# EAGLE schematic ElectricalSchematic v11 (EAGLE 9.7.0)
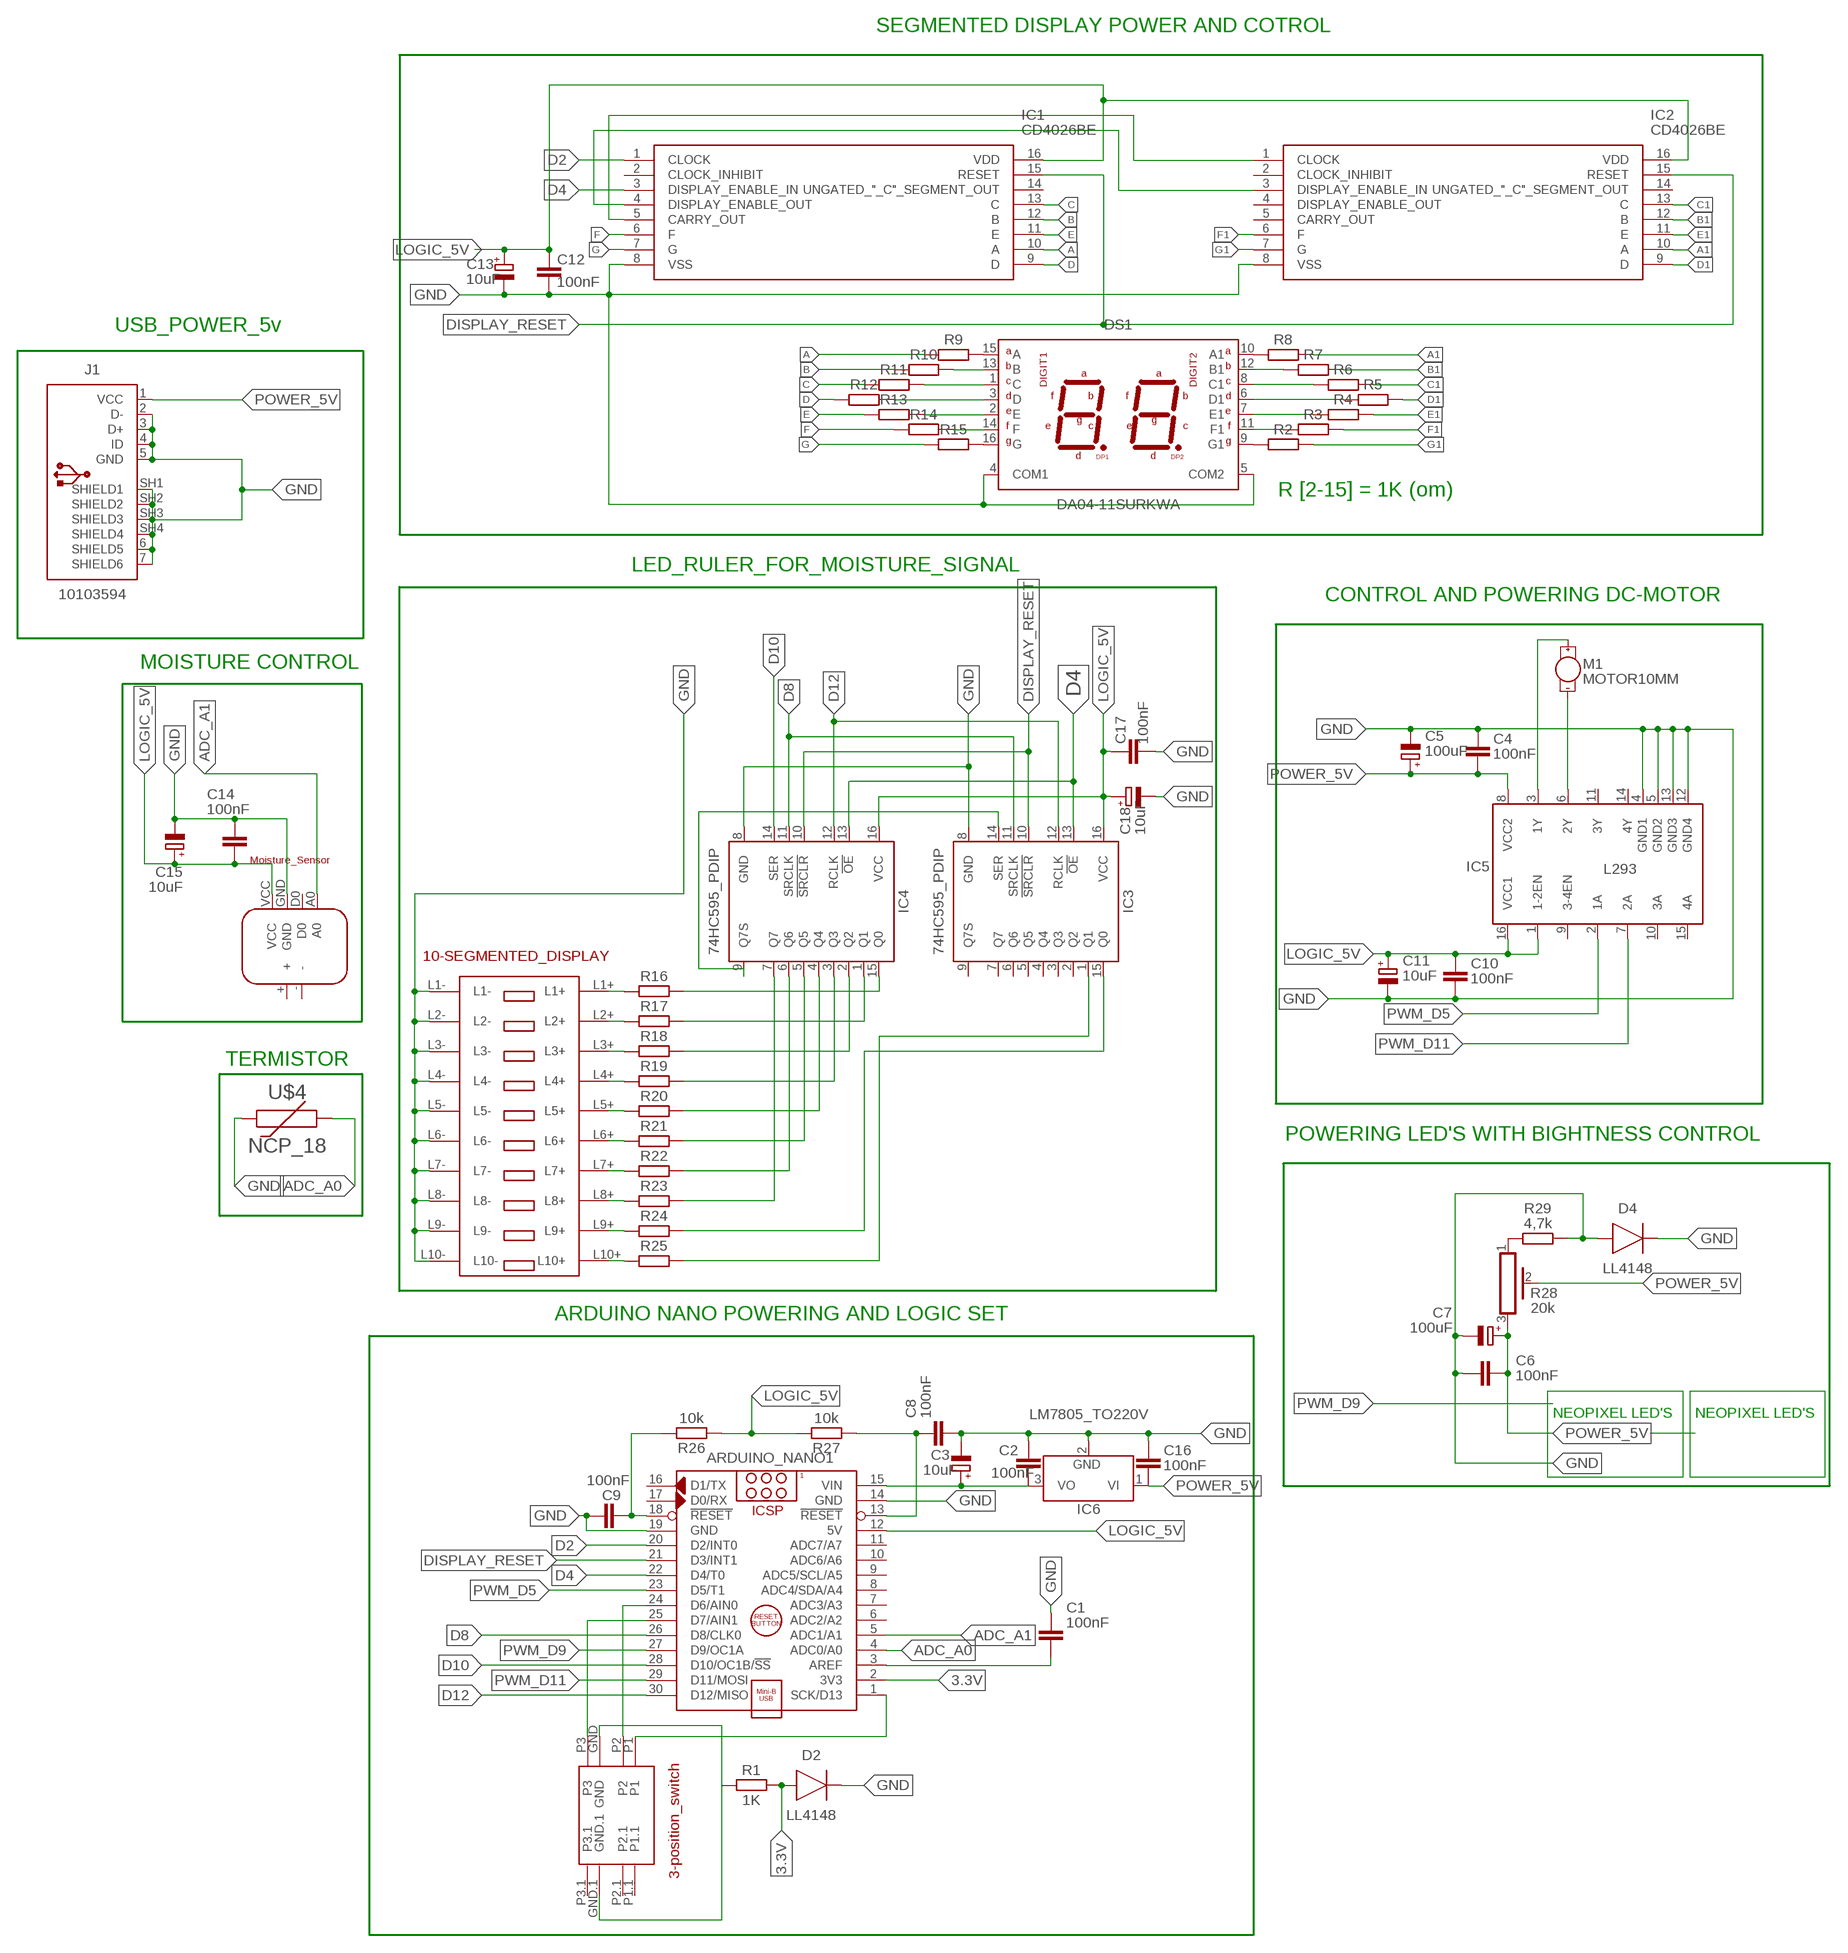
[diagram p0: schematic, sheet 1]

## Parts
ARDUINO_NANO1  ARDUINO_NANO  [ARDUINO_NANO]
C1  100nF  C_RADIAL-55.5MM-DIA  [CAPRD2261W240D5080H5555B]
C2  100nF  C_RADIAL-55.5MM-DIA  [CAPRD2261W240D5080H5555B]
C3  10uF  C-POL_RADIAL-11MM-DIA  [CAPPRD508W65D1000H1100B]
C4  100nF  C_RADIAL-55.5MM-DIA  [CAPRD2261W240D5080H5555B]
C5  100uF  C-POL_RADIAL-11MM-DIA  [CAPPRD508W65D1000H1100B]
C6  100nF  C_RADIAL-55.5MM-DIA  [CAPRD2261W240D5080H5555B]
C7  100uF  C-POL_RADIAL-11MM-DIA  [CAPPRD508W65D1000H1100B]
C8  100nF  C_RADIAL-55.5MM-DIA  [CAPRD2261W240D5080H5555B]
C9  100nF  C_RADIAL-55.5MM-DIA  [CAPRD2261W240D5080H5555B]
C10  100nF  C_RADIAL-55.5MM-DIA  [CAPRD2261W240D5080H5555B]
C11  10uF  C-POL_RADIAL-11MM-DIA  [CAPPRD508W65D1000H1100B]
C12  100nF  C_RADIAL-55.5MM-DIA  [CAPRD2261W240D5080H5555B]
C13  10uF  C-POL_RADIAL-11MM-DIA  [CAPPRD508W65D1000H1100B]
C14  100nF  C_RADIAL-55.5MM-DIA  [CAPRD2261W240D5080H5555B]
C15  10uF  C-POL_RADIAL-11MM-DIA  [CAPPRD508W65D1000H1100B]
C16  100nF  C_RADIAL-55.5MM-DIA  [CAPRD2261W240D5080H5555B]
C17  100nF  C_RADIAL-55.5MM-DIA  [CAPRD2261W240D5080H5555B]
C18  10uF  C-POL_RADIAL-11MM-DIA  [CAPPRD508W65D1000H1100B]
D2  LL4148  DIODE_LL4148_SOD-80  [DIOMELF3516]
D4  LL4148  DIODE_LL4148_SOD-80  [DIOMELF3516]
DS1  DA04-11SURKWA  [D*04-11SURKWA]
IC1  CD4026BE  [DIP794W53P254L1930H508Q16N]
IC2  CD4026BE  [DIP794W53P254L1930H508Q16N]
IC3  74HC595_PDIP  [DIP762W53P254L1969H508Q16B]
IC4  74HC595_PDIP  [DIP762W53P254L1969H508Q16B]
IC5  L293  [DIP762W53P254L1969H508Q16B]
IC6  LM7805_TO220V  [TO220V]
J1  10103594  [10103594]
M1  MOTOR10MM  [VIBE-MOTOR-10MM]
R1  1K  R_AXIAL-7.2MM-PITCH  [RESAD724W46L381D178B]
R2  R_AXIAL-7.2MM-PITCH  [RESAD724W46L381D178B]
R3  R_AXIAL-7.2MM-PITCH  [RESAD724W46L381D178B]
R4  R_AXIAL-7.2MM-PITCH  [RESAD724W46L381D178B]
R5  R_AXIAL-7.2MM-PITCH  [RESAD724W46L381D178B]
R6  R_AXIAL-7.2MM-PITCH  [RESAD724W46L381D178B]
R7  R_AXIAL-7.2MM-PITCH  [RESAD724W46L381D178B]
R8  R_AXIAL-7.2MM-PITCH  [RESAD724W46L381D178B]
R9  R_AXIAL-7.2MM-PITCH  [RESAD724W46L381D178B]
R10  R_AXIAL-7.2MM-PITCH  [RESAD724W46L381D178B]
R11  R_AXIAL-7.2MM-PITCH  [RESAD724W46L381D178B]
R12  R_AXIAL-7.2MM-PITCH  [RESAD724W46L381D178B]
R13  R_AXIAL-7.2MM-PITCH  [RESAD724W46L381D178B]
R14  R_AXIAL-7.2MM-PITCH  [RESAD724W46L381D178B]
R15  R_AXIAL-7.2MM-PITCH  [RESAD724W46L381D178B]
R16  R_AXIAL-7.2MM-PITCH  [RESAD724W46L381D178B]
R17  R_AXIAL-7.2MM-PITCH  [RESAD724W46L381D178B]
R18  R_AXIAL-7.2MM-PITCH  [RESAD724W46L381D178B]
R19  R_AXIAL-7.2MM-PITCH  [RESAD724W46L381D178B]
R20  R_AXIAL-7.2MM-PITCH  [RESAD724W46L381D178B]
R21  R_AXIAL-7.2MM-PITCH  [RESAD724W46L381D178B]
R22  R_AXIAL-7.2MM-PITCH  [RESAD724W46L381D178B]
R23  R_AXIAL-7.2MM-PITCH  [RESAD724W46L381D178B]
R24  R_AXIAL-7.2MM-PITCH  [RESAD724W46L381D178B]
R25  R_AXIAL-7.2MM-PITCH  [RESAD724W46L381D178B]
R26  10k  R_AXIAL-7.2MM-PITCH  [RESAD724W46L381D178B]
R27  10k  R_AXIAL-7.2MM-PITCH  [RESAD724W46L381D178B]
R28  20k  PV36Z  [PV36Z]
R29  4,7k  R_AXIAL-7.2MM-PITCH  [RESAD724W46L381D178B]
U$2  10-SEGMENTED_DISPLAY10-SEGMENTED_DISPLAY_V2  [10-SEGMENTED_DIS_FOOTPRINT]
U$3  3POZ_SWITCH  [3-POZ-SWITCH]
U$4  NCP_18  [THRMC1608X95]
U$5  MOISTURE_SENSOR  [MOISTURE]

## Nets
3.3V: ARDUINO_NANO1.2(3V3) D2.2(A) R1.2
A: IC1.10(A) R9.1
A1: IC2.10(A) R8.2
ADC_A0: ARDUINO_NANO1.4(ADC0/A0) U$4.2
ADC_A1: ARDUINO_NANO1.5(ADC1/A1) U$5.A0
B: IC1.12(B) R10.1
B1: IC2.12(B) R7.2
C: IC1.13(C) R11.1
C1: IC2.13(C) R6.2
CONNECTING_OTHER_74HC: IC3.14(SER) IC4.9(Q7S)
D: IC1.9(D) R12.1
D1: IC2.9(D) R5.2
D2: ARDUINO_NANO1.20(D2/INT0) IC1.1(CLOCK)
D4: ARDUINO_NANO1.22(D4/T0) IC1.3(DISPLAY_ENABLE_IN) IC3.13(!OE) IC4.13(!OE)
D8: ARDUINO_NANO1.26(D8/CLK0) IC3.11(SRCLK) IC4.11(SRCLK)
D10: ARDUINO_NANO1.28(D10/OC1B/!SS) IC4.14(SER)
D12: ARDUINO_NANO1.30(D12/MISO) IC3.12(RCLK) IC4.12(RCLK)
DISPLAY_RESET: ARDUINO_NANO1.21(D3/INT1) IC1.15(RESET) IC2.15(RESET) IC3.10(!SRCLR) IC4.10(!SRCLR)
E: IC1.11(E) R13.1
E1: IC2.11(E) R4.2
F: IC1.6(F) R14.1
F1: IC2.6(F) R3.2
G: IC1.7(G) R15.1
G1: IC2.7(G) R2.2
GND: ARDUINO_NANO1.14(GND) ARDUINO_NANO1.19(GND) C1.1 C2.2 C3.2(-) C4.2 C5.2(-) C6.1 C7.2(-) C8.2 C9.1 C10.1 C11.2(-) C12.1 C13.2(-) C14.2 C15.2(-) C16.2 C17.1 C18.2(-) D2.1(C) D4.1(C) D4.2(A) DS1.4(COM1) DS1.5(COM2) IC1.8(VSS) IC2.8(VSS) IC3.8(GND) IC4.8(GND) IC5.4(GND1) IC5.5(GND2) IC5.12(GND4) IC5.13(GND3) IC6.2(GND) J1.2(D-) J1.3(D+) J1.4(ID) J1.5(GND) J1.6(SHIELD5) J1.7(SHIELD6) J1.SH1(SHIELD1) J1.SH2(SHIELD2) J1.SH3(SHIELD3) J1.SH4(SHIELD4) R29.2 U$2.L1- U$2.L2- U$2.L3- U$2.L4- U$2.L5- U$2.L6- U$2.L7- U$2.L8- U$2.L9- U$2.L10- U$4.1 U$5.GND
LOGIC_5V: ARDUINO_NANO1.12(5V) C10.2 C11.1(+) C12.2 C13.1(+) C14.1 C15.1(+) C17.2 C18.1(+) IC1.16(VDD) IC2.16(VDD) IC3.16(VCC) IC4.16(VCC) IC5.1(1-2EN) IC5.16(VCC1) R26.1 R27.2 U$5.VCC
N$3: IC4.15(Q0) R16.2
N$4: IC4.1(Q1) R17.2
N$5: ARDUINO_NANO1.3(AREF) C1.2
N$6: IC4.2(Q2) R18.2
N$7: IC4.3(Q3) R19.2
N$8: IC4.4(Q4) R20.2
N$9: IC4.5(Q5) R21.2
N$10: IC4.6(Q6) R22.2
N$11: IC4.7(Q7) R23.2
N$12: IC3.15(Q0) R24.2
N$13: IC1.4(DISPLAY_ENABLE_OUT) IC2.3(DISPLAY_ENABLE_IN)
N$14: IC1.5(CARRY_OUT) IC2.1(CLOCK)
N$15: IC3.1(Q1) R25.2
N$17: R1.1
N$18: ARDUINO_NANO1.1(SCK/D13) U$3.P1
N$19: ARDUINO_NANO1.24(D6/AIN0) U$3.P2
N$20: ARDUINO_NANO1.25(D7/AIN1) U$3.P3
N$21: U$3.GND U$3.GND.1
N$38: DS1.11(F1) R3.1
N$39: DS1.9(G1) R2.1
N$40: DS1.7(E1) R4.1
N$41: DS1.12(B1) R7.1
N$42: DS1.8(C1) R6.1
N$43: DS1.6(D1) R5.1
N$44: DS1.10(A1) R8.1
N$45: DS1.15(A) R9.2
N$46: DS1.13(B) R10.2
N$47: DS1.1(C) R11.2
N$48: DS1.3(D) R12.2
N$49: DS1.2(E) R13.2
N$50: DS1.14(F) R14.2
N$51: DS1.16(G) R15.2
N$52: R16.1 U$2.L1+
N$53: R17.1 U$2.L2+
N$54: R18.1 U$2.L3+
N$55: R19.1 U$2.L4+
N$56: R20.1 U$2.L5+
N$57: R21.1 U$2.L6+
N$58: R22.1 U$2.L7+
N$59: R23.1 U$2.L8+
N$60: R24.1 U$2.L9+
N$61: R25.1 U$2.L10+
N$62: ARDUINO_NANO1.18(!RESET) C9.2 R26.2
N$63: IC5.3(1Y) M1.+
N$64: IC5.6(2Y) M1.-
N$70: R28.1 R29.1
POWER_5V: ARDUINO_NANO1.15(VIN) C2.1 C3.1(+) C4.1 C5.1(+) C6.2 C7.1(+) C16.1 IC5.8(VCC2) IC6.1(VI) IC6.3(VO) J1.1(VCC) R28.2 R28.3
PWM_D5: ARDUINO_NANO1.23(D5/T1) IC5.2(1A)
PWM_D9: ARDUINO_NANO1.27(D9/OC1A)
PWM_D11: ARDUINO_NANO1.29(D11/MOSI) IC5.7(2A)
VCC: ARDUINO_NANO1.13(!RESET) C8.1 R27.1
Unconnected: ARDUINO_NANO1.6(ADC2/A2) ARDUINO_NANO1.7(ADC3/A3) ARDUINO_NANO1.8(ADC4/SDA/A4) ARDUINO_NANO1.9(ADC5/SCL/A5) ARDUINO_NANO1.10(ADC6/A6) ARDUINO_NANO1.11(ADC7/A7) ARDUINO_NANO1.16(D1/TX) ARDUINO_NANO1.17(D0/RX) IC1.2(CLOCK_INHIBIT) IC1.14(UNGATED_"_C"_SEGMENT_OUT) IC2.2(CLOCK_INHIBIT) IC2.4(DISPLAY_ENABLE_OUT) IC2.5(CARRY_OUT) IC2.14(UNGATED_"_C"_SEGMENT_OUT) IC3.2(Q2) IC3.3(Q3) IC3.4(Q4) IC3.5(Q5) IC3.6(Q6) IC3.7(Q7) IC3.9(Q7S) IC5.9(3-4EN) IC5.10(3A) IC5.11(3Y) IC5.14(4Y) IC5.15(4A) U$3.P1.1 U$3.P2.1 U$3.P3.1 U$5.+ U$5.- U$5.D0

## Notes on the sheet
- SEGMENTED DISPLAY POWER AND COTROL
- USB_POWER_5v
- R [2-15] = 1K (om)
- LED_RULER_FOR_MOISTURE_SIGNAL
- CONTROL AND POWERING DC-MOTOR
- MOISTURE CONTROL
- TERMISTOR
- POWERING LED'S WITH BIGHTNESS CONTROL
- ARDUINO NANO POWERING AND LOGIC SET
- NEOPIXEL LED'S | NEOPIXEL LED'S

## Library data of the parts
ARDUINO_NANO1 = ArduinoNanoV30:ARDUINO_NANO: Arduino Nano V3.0 Module Overview: The Arduino Nano is a small, complete, and breadboard-friendly board based on the ATmega328 (Arduino Nano 3.x) or ATmega168 (Arduino Nano 2.x). It has more or less the same functionality of the Arduino Duemilanove, but in a different package. It lacks only a DC power jack, and works with a Mini-B USB cable instead of a standard one. The Nano was designed and is being produced by Gravitech <http://www.gravitech.us/arna30wiatp.html>. General specifications: Item Value Microcontroller Atmel ATmega168 or ATmega328 Operating Voltage (logic level) 5 V Input Voltage (recommended) 7-12 V Input Voltage (limits) 6-20 V Digital I/O Pins 14 (of which 6 provide PWM output) Analog Input Pins 8 DC Current per I/O Pin 40 mA Flash Memory 16 KB (ATmega168) or 32 KB (ATmega328) of which 2 KB used by bootloader SRAM 1 KB (ATmega168) or 2 KB (ATmega328) EEPROM 512 bytes (ATmega168) or 1 KB (ATmega328) Clock Speed 16 MHz Dimensions (Inches) 0.73" x 1.70" Dimensions (mm) 18mm x 45mm Overall height About 9 mm (not including pins) Weigth 5 g Power: The Arduino Nano can be powered via the Mini-B USB connection, 6-20V unregulated external power supply (pin 30), or 5V regulated external power supply (pin 27). The power source is automatically selected to the highest voltage source. Memory: The ATmega168 has 16 KB of flash memory for storing code (of which 2 KB is used for the bootloader); the ATmega328 has 32 KB, (also with 2 KB used for the bootloader). The ATmega168 has 1 KB of SRAM and 512 bytes of EEPROM (which can be read and written with the EEPROM library); the ATmega328 has 2 KB of SRAM and 1 KB of EEPROM. Input and Output: Each of the 14 digital pins on the Nano can be used as an input or output, using pinMode(), digitalWrite(), and digitalRead() functions. They operate at 5 volts. Each pin can provide or receive a maximum of 40 mA and has an internal pull-up resistor (disconnected by default) of 20-50 kOhms. In addition, some pins have specialized functions. Visit Arduino - ArduinoBoardNano <https://www.arduino.cc/en/Main/ArduinoBoardNano>
C1 = Tutorial - Fusion 360:C: Capacitor - Generic; CATEGORY: Capacitor
C2 C4 C6 C8-C10 C12 C14 C16 C17 = Capacitor:C: Capacitor - Generic; CATEGORY: Capacitor
C3 C5 C7 C11 C13 C15 C18 = Capacitor:C-POL: Capacitor Polarised - Generic; CATEGORY: Capacitor
D2 D4 = Diode:DIODE_: Diode Rectifier - Popular parts; CATEGORY: Diode; DESCRIPTION: DIODE GEN PURP 100V 200MA SOD80; MANUFACTURER: ON Semiconductor; SUB-CATEGORY: Rectifier
DS1 = Display_LED:D*04-11SURKWA: Dual Digit Numeric Display - 7SEG, 0.4" Character size, RED, 16DIP, THT Datasheet-DA04-11SURKWA <https://www.kingbrightusa.com/images/catalog/SPEC/DA04-11SURKWA.pdf> Datasheet-DC04-11SURKWA <https://www.kingbrightusa.com/images/catalog/SPEC/DC04-11SURKWA.pdf>; CATEGORY: DISPLAY; COLOR: Hyper Red (AlGaInP); CONFIGURATION: Common Anode; DESCRIPTION: 10 mm (0.4 inch) Dual Digit Numeric Display in Common Anode Configuration; DIGIT: Dual Digit; MANUFACTURER: Kingbright; MPN: DA04-11SURKWA; OPERATING_TEMP: -40°C to +85 °C; PART_STATUS: Active; ROHS_COMPLIANT: COMPLIANT; SERIES: -; SUB-CATEGORY: LED; THERMALLOSS: 0.075 W; TYPE: 7 Segment
IC1 IC2 = CD4026BE:CD4026BE: CD4026BE, 5-stage Decade Counter/Divider, Decade, Up Counter, 3 18 V, 16-Pin PDIP Source: Datasheet <http://www.ti.com/lit/ds/symlink/cd4026b.pdf>; ARROW_PART_NUMBER: CD4026BE; ARROW_PRICE-STOCK: https://www.arrow.com/en/products/cd4026be/texas-instruments?region=nac; DESCRIPTION: CD4026BE, 5-stage Decade Counter/Divider, Decade, Up Counter, 3 18 V, 16-Pin PDIP; HEIGHT: 5.08mm; MANUFACTURER_NAME: Texas Instruments; MANUFACTURER_PART_NUMBER: CD4026BE; MOUSER_PART_NUMBER: 595-CD4026BE; MOUSER_PRICE-STOCK: https://www.mouser.co.uk/ProductDetail/Texas-Instruments/CD4026BE?qs=bkMXpVdiF42nXhwyXNpecA%3D%3D
IC3 IC4 = IC_Logic:74HC595: 8-Bit Shift Registers Reference Datasheet <https://www.ti.com/lit/ds/symlink/sn74hc595.pdf?ts=1637559852861&ref_url=https%253A%252F%252Fwww.google.com%252F>; CATEGORY: IC_Logic; DESCRIPTION: 8-Bit Shift Registers; MANUFACTURER: Generic; MPN: Generic; SUB-CATEGORY: Shift Register; TYPE: 8-bit
IC5 = IC_Power-Management:L293: L293D H-bridge motor driver Datasheet <https://www.ti.com/lit/ds/symlink/l293.pdf>; CATEGORY: IC_Linear; DESCRIPTION: Bipolar Motor Driver; MANUFACTURER: Generic; MPN: Generic; SERIES: L293; SUB-CATEGORY: Motor Driver; TYPE: Bipolar
IC6 = IC_Power-Management:LM7805: 5V Voltage Regulator Reference Datasheet <https://www.ti.com/lit/ds/symlink/lm340.pdf>; CATEGORY: IC_Linear; DESCRIPTION: 5V Voltage Regulator; MANUFACTURER: Generic; MPN: Generic; SERIES: LM7805; SUB-CATEGORY: Voltage Regulator; TYPE: 5V
J1 = Connector_USB:10103594: USB(2.0) Micro-B, RCPT, 5POS, SMD-THT-R/A Datasheet <https://cdn.amphenol-icc.com/media/wysiwyg/files/documentation/datasheet/inputoutput/io_usb_micro.pdf> Drawing <https://cdn.amphenol-icc.com/media/wysiwyg/files/drawing/10103594.pdf>; CATEGORY: Connectors; CONTACTS: 5; CURRENT-RATING: 1.8A; DESCRIPTION: CONN RCPT USB2.0 MICRO B SMD R/A; GENDER: Receptacle; MANUFACTURER: Amphenol ICC (FCI); MOUNT_TYPE: R/A; MPN: 10103594-0001LF; OPERATING_TEMPERATURE: -30°C ~ 80°C; PART_STATUS: ACTIVE; ROHS_COMPLIANT: COMPLIANT; SUB_CATEGORY: USB; TYPE: USB-micro B; VOLTAGE-RATING: 100VAC
M1 = SparkFun-Electromechanical:MOTOR: Motor (Single-Phase) Two-terminal, single-phase motors. SparkFun Products Vibration Motor <https://www.sparkfun.com/products/8449> (ROB-08449) Physical dimension and wire connections for this powerful vibration motor. Motor has a self adhesive backing.; PROD_ID: COMP-08572; SF_SKU: ROB-08449
R1-R27 R29 = Resistor:R: Resistor Fixed - Generic; CATEGORY: Resistor; SUB-CATEGORY: Fixed
R28 = Resistor:PV36: Rectangular Trimmer Potentiometers - PV36 Series Datasheet <https://www.bourns.com/docs/Product-Datasheets/pv36.pdf>; CATEGORY: Resistor; DESCRIPTION: Lead Sealed Type Multiturn PV36 Series; MANUFACTURER: BOURNS; MPN: PV36Z; OPERATING_TEMPERATURE: -55 to +125 °C; PART_STATUS: Active; ROHS_COMPLIANCE: RoHS Compliant; SERIES: PV36; SUB-CATEGORY: Trimpot; TYPE: Lead Sealed
U$2 = S.M.A.R.T.Pot_PCB_Parts:10-SEGMENTED_DISPLAY
U$3 = S.M.A.R.T.Pot_PCB_Parts:3POZ_SWITCH
U$4 = Sensor:NCP: NTC Thermistor NCP03,NCP15,NCP18 : Datasheet <https://www.mouser.in/datasheet/2/281/r44e-522712.pdf>; CATEGORY: SENSOR; DESCRIPTION: NTC Thermister; MANUFACTURER: Murata; MPN: NCP18; OPERATING_TEMPERATURE: -40℃ to 125℃; PART_STATUS: Active; ROHS_COMPLIANCE: RoHS Compliant; SERIES: NCP18; SUB-CATEGORY: Temperature; TYPE: NTC
U$5 = S.M.A.R.T.Pot_PCB_Parts:MOISTURE_SENSOR